# EAGLE design Routing_option1a (EAGLE 9.6.2)
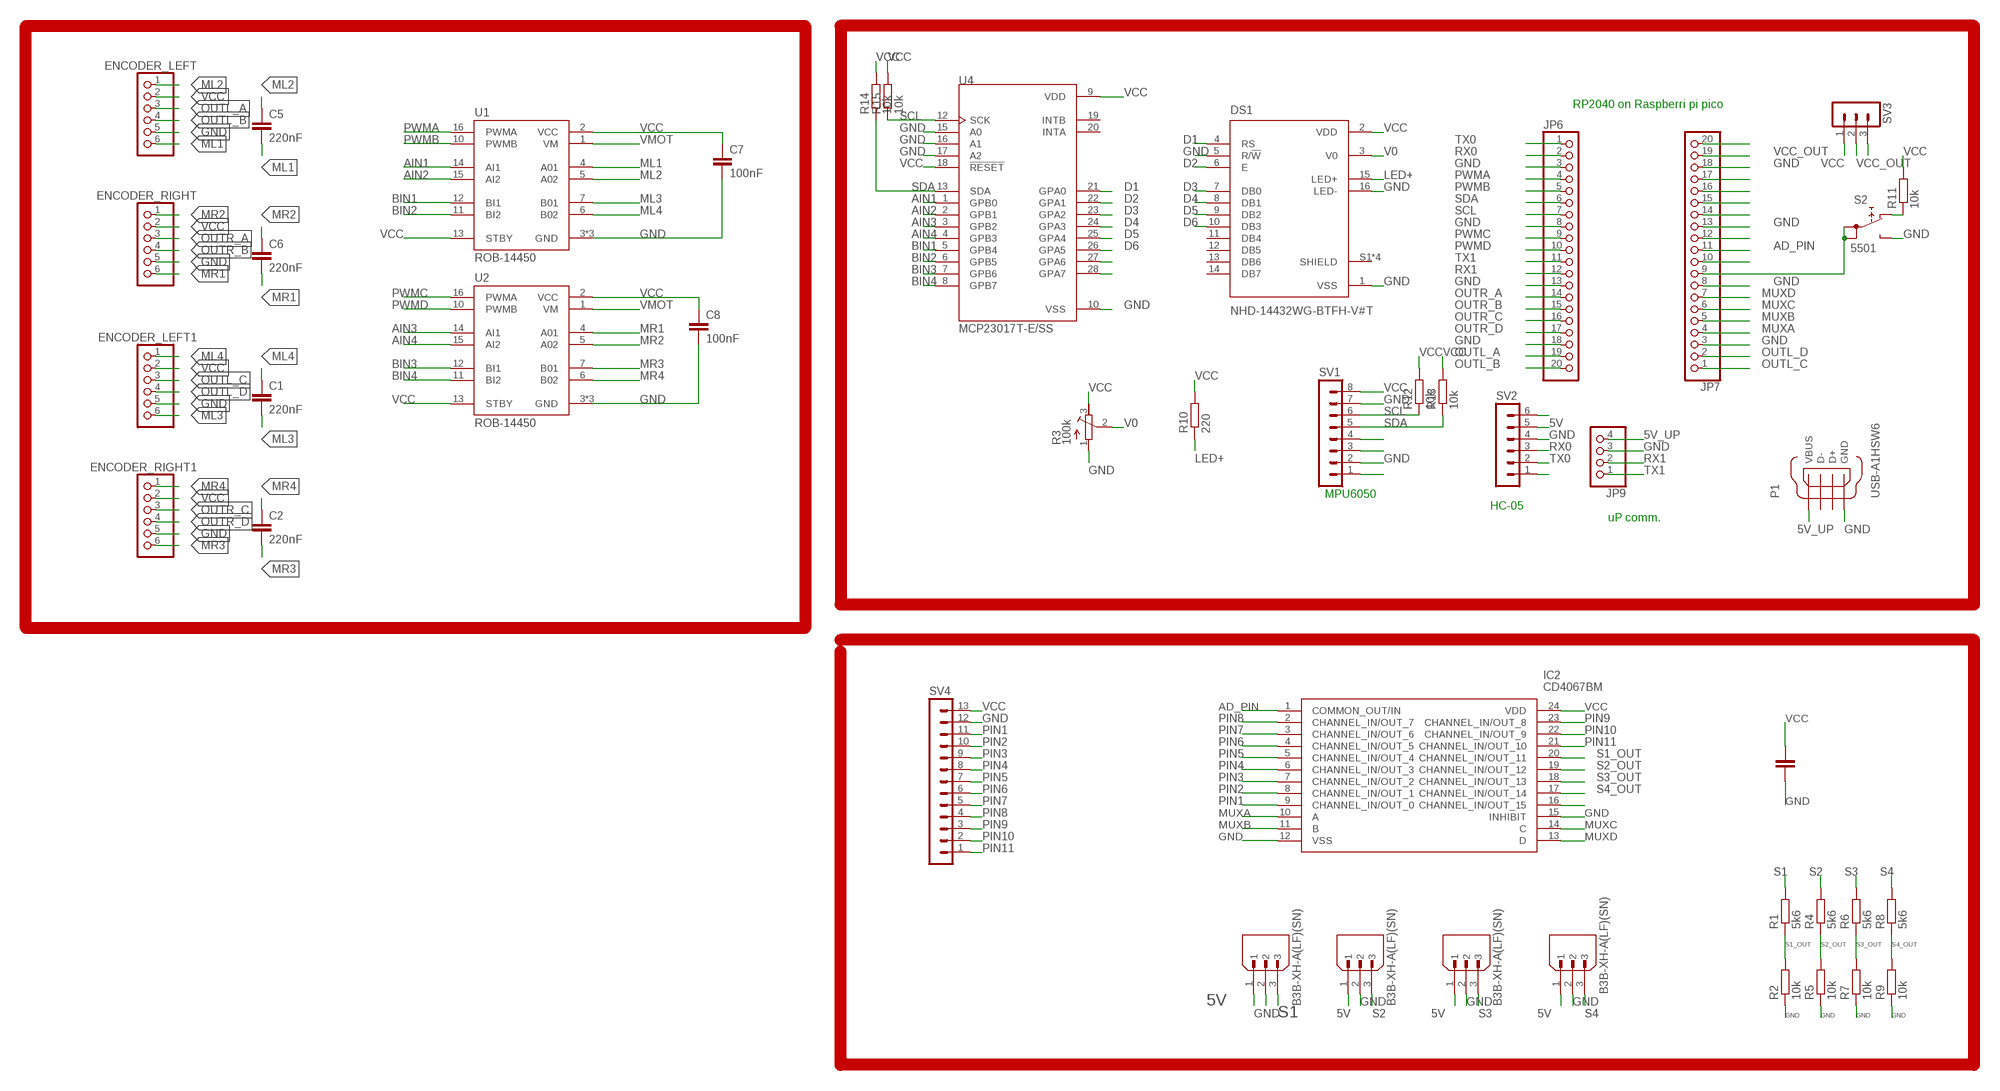
[diagram p0: schematic, sheet 1, part 1 of 2]
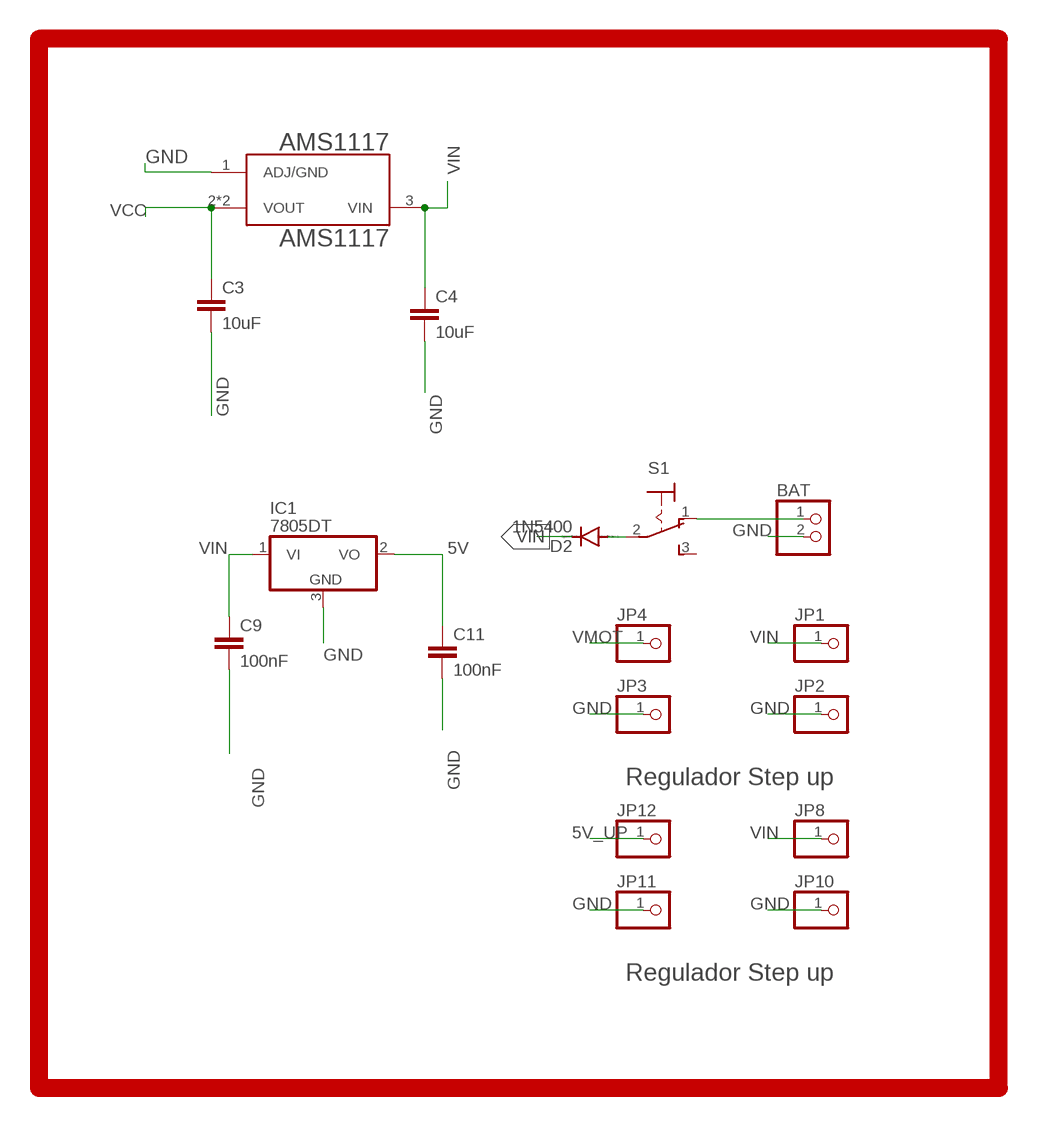
[diagram p1: schematic, sheet 1, part 2 of 2]

## Parts
AMS1117  AMS1117  [SOT229P700X180-4N]
BAT  PINHD-1X2  [1X02]
C1  220nF  C-EUC0805  [C0805]
C2  220nF  C-EUC0805  [C0805]
C3  10uF  C-EUC0805  [C0805]
C4  10uF  C-EUC0805  [C0805]
C5  220nF  C-EUC0805  [C0805]
C6  220nF  C-EUC0805  [C0805]
C7  100nF  C-EUC0805  [C0805]
C8  100nF  C-EUC0805  [C0805]
C9  100nF  C-EUC0805  [C0805]
C10  100nF  C-EUC0805  [C0805]
C11  100nF  C-EUC0805  [C0805]
D2  1N5400  [DO201-15]
DIR  B3B-XH-A(LF)(SN)  [JST_B3B-XH-A(LF)(SN)]
DS1  NHD-14432WG-BTFH-V#T  [LCD_NHD-14432WG-BTFH-V#T]
ENCODER_LEFT  PINHD-1X6  [1X06]
ENCODER_LEFT1  PINHD-1X6  [1X06]
ENCODER_RIGHT  PINHD-1X6  [1X06]
ENCODER_RIGHT1  PINHD-1X6  [1X06]
ESQ  B3B-XH-A(LF)(SN)  [JST_B3B-XH-A(LF)(SN)]
FRENT  B3B-XH-A(LF)(SN)  [JST_B3B-XH-A(LF)(SN)]
IC1  7805DT  [TO252]
IC2  CD4067BM  [SOIC127P1030X265-24N]
JP1  PINHD-1X1  [1X01]
JP2  PINHD-1X1  [1X01]
JP3  PINHD-1X1  [1X01]
JP4  PINHD-1X1  [1X01]
JP6  PINHD-1X20  [1X20]
JP7  PINHD-1X20  [1X20]
JP8  PINHD-1X1  [1X01]
JP9  PINHD-1X4  [1X04]
JP10  PINHD-1X1  [1X01]
JP11  PINHD-1X1  [1X01]
JP12  PINHD-1X1  [1X01]
P1  USB-A1HSW6  [OST_USB-A1HSW6]
R1  5k6  R-EU_R0805  [R0805]
R2  10k  R-EU_R0805  [R0805]
R3  100k  R-TRIMM64W  [RTRIM64W]
R4  5k6  R-EU_R0805  [R0805]
R5  10k  R-EU_R0805  [R0805]
R6  5k6  R-EU_R0805  [R0805]
R7  10k  R-EU_R0805  [R0805]
R8  5k6  R-EU_R0805  [R0805]
R9  10k  R-EU_R0805  [R0805]
R10  220  R-EU_R0805  [R0805]
R11  10k  R-EU_R0805  [R0805]
R12  10k  R-EU_R0805  [R0805]
R13  10k  R-EU_R0805  [R0805]
R14  10k  R-EU_R0805  [R0805]
R15  10k  R-EU_R0805  [R0805]
S1  320-916  [320-916]
S2  5501  [5501]
SV1  MA08-1  [MA08-1]
SV2  MA06-1  [MA06-1]
SV3  MA03-1  [MA03-1]
SV4  MA13-1  [MA13-1]
TRAS  B3B-XH-A(LF)(SN)  [JST_B3B-XH-A(LF)(SN)]
U1  ROB-14450  [MODULE_ROB-14450]
U2  ROB-14450  [MODULE_ROB-14450]
U4  MCP23017T-E/SS  [SOP65P780X200-28N]

## Nets
5V: C11.1 DIR.1 ESQ.1 FRENT.1 IC1.2(VO) SV2.5 TRAS.1
5V_UP: JP9.4 JP12.1 P1.1(VBUS)
AD1: JP7.12
AD2: JP7.14
AD_PIN: IC2.1(COMMON_OUT/IN) JP7.11
AIN1: U1.14(AI1) U4.1(GPB0)
AIN2: U1.15(AI2) U4.2(GPB1)
AIN3: U2.14(AI1) U4.3(GPB2)
AIN4: U2.15(AI2) U4.4(GPB3)
BIN1: U1.12(BI1) U4.5(GPB4)
BIN2: U1.11(BI2) U4.6(GPB5)
BIN3: U2.12(BI1) U4.7(GPB6)
BIN4: U2.11(BI2) U4.8(GPB7)
D1: DS1.4(RS) U4.21(GPA0)
D2: DS1.6(E) U4.22(GPA1)
D3: DS1.7(DB0) U4.23(GPA2)
D4: DS1.8(DB1) U4.24(GPA3)
D5: DS1.9(DB2) U4.25(GPA4)
D6: DS1.10(DB3) U4.26(GPA5)
GND: AMS1117.1(ADJ/GND) BAT.2 C3.2 C4.2 C7.2 C8.2 C9.2 C10.2 C11.2 DIR.2 DS1.1(VSS) DS1.5(R/!W) DS1.16(LED-) ENCODER_LEFT1.5 ENCODER_LEFT.5 ENCODER_RIGHT1.5 ENCODER_RIGHT.5 ESQ.2 FRENT.2 IC1.3(GND) IC2.12(VSS) IC2.15(INHIBIT) JP2.1 JP3.1 JP6.3 JP6.8 JP6.13 JP6.18 JP7.3 JP7.8 JP7.13 JP7.18 JP9.3 JP10.1 JP11.1 P1.4(GND) R2.1 R3.1(A) R5.1 R7.1 R9.1 S2.NO SV1.2 SV1.7 SV2.4 SV4.12 TRAS.2 U1.3(GND) U1.8(GND) U1.9(GND) U2.3(GND) U2.8(GND) U2.9(GND) U4.10(VSS) U4.15(A0) U4.16(A1) U4.17(A2)
LED+: DS1.15(LED+) R10.1
ML1: C5.2 ENCODER_LEFT.6 U1.4(A01)
ML2: C5.1 ENCODER_LEFT.1 U1.5(A02)
ML3: C1.2 ENCODER_LEFT1.6 U1.7(B01)
ML4: C1.1 ENCODER_LEFT1.1 U1.6(B02)
MR1: C6.2 ENCODER_RIGHT.6 U2.4(A01)
MR2: C6.1 ENCODER_RIGHT.1 U2.5(A02)
MR3: C2.2 ENCODER_RIGHT1.6 U2.7(B01)
MR4: C2.1 ENCODER_RIGHT1.1 U2.6(B02)
MUXA: IC2.10(A) JP7.4
MUXB: IC2.11(B) JP7.5
MUXC: IC2.14(C) JP7.6
MUXD: IC2.13(D) JP7.7
N$2: D2.A S1.2(P)
N$3: BAT.1 S1.1(O)
N$4: R11.1 S2.NC
N$5: SV3.3
N$13: SV1.4
N$14: SV1.3
N$16: SV1.1
N$17: SV2.6
N$26: SV2.1
N$47: U4.27(GPA6)
N$48: U4.28(GPA7)
NET$4: JP7.20
NET$5: JP7.17
NET$6: JP7.16
NET$7: JP7.15
NET$8: JP7.10
NET$15: JP7.9 S2.1A S2.1B
OUTL_A: ENCODER_LEFT.3 JP6.19
OUTL_B: ENCODER_LEFT.4 JP6.20
OUTL_C: ENCODER_LEFT1.3 JP7.1
OUTL_D: ENCODER_LEFT1.4 JP7.2
OUTR_A: ENCODER_RIGHT.3 JP6.14
OUTR_B: ENCODER_RIGHT.4 JP6.15
OUTR_C: ENCODER_RIGHT1.3 JP6.16
OUTR_D: ENCODER_RIGHT1.4 JP6.17
PIN1: IC2.9(CHANNEL_IN/OUT_0) SV4.11
PIN2: IC2.8(CHANNEL_IN/OUT_1) SV4.10
PIN3: IC2.7(CHANNEL_IN/OUT_2) SV4.9
PIN4: IC2.6(CHANNEL_IN/OUT_3) SV4.8
PIN5: IC2.5(CHANNEL_IN/OUT_4) SV4.7
PIN6: IC2.4(CHANNEL_IN/OUT_5) SV4.6
PIN7: IC2.3(CHANNEL_IN/OUT_6) SV4.5
PIN8: IC2.2(CHANNEL_IN/OUT_7) SV4.4
PIN9: IC2.23(CHANNEL_IN/OUT_8) SV4.3
PIN10: IC2.22(CHANNEL_IN/OUT_9) SV4.2
PIN11: IC2.21(CHANNEL_IN/OUT_10) SV4.1
PWMA: JP6.4 U1.16(PWMA)
PWMB: JP6.5 U1.10(PWMB)
PWMC: JP6.9 U2.16(PWMA)
PWMD: JP6.10 U2.10(PWMB)
RX0: JP6.2 SV2.3
RX1: JP6.12 JP9.2
S1: FRENT.3 R1.2
S1_OUT: IC2.20(CHANNEL_IN/OUT_11) R1.1 R2.2
S2: ESQ.3 R4.2
S2_OUT: IC2.19(CHANNEL_IN/OUT_12) R4.1 R5.2
S3: DIR.3 R6.2
S3_OUT: IC2.18(CHANNEL_IN/OUT_13) R6.1 R7.2
S4: R8.2 TRAS.3
S4_OUT: IC2.17(CHANNEL_IN/OUT_14) R8.1 R9.2
S5: IC2.16(CHANNEL_IN/OUT_15)
SCL: JP6.7 R12.1 R15.1 SV1.6 U4.12(SCK)
SDA: JP6.6 R13.1 R14.1 SV1.5 U4.13(SDA)
TX0: JP6.1 SV2.2
TX1: JP6.11 JP9.1
V0: DS1.3(V0) R3.2(S)
VCC: AMS1117.2(VOUT) AMS1117.4(VOUT) C3.1 C7.1 C8.1 C10.1 DS1.2(VDD) ENCODER_LEFT1.2 ENCODER_LEFT.2 ENCODER_RIGHT1.2 ENCODER_RIGHT.2 IC2.24(VDD) R3.3(E) R10.2 R11.2 R12.2 R13.2 R14.2 R15.2 SV1.8 SV3.1 SV4.13 U1.2(VCC) U1.13(STBY) U2.2(VCC) U2.13(STBY) U4.9(VDD) U4.18(!RESET)
VCC_OUT: JP7.19 SV3.2
VIN: AMS1117.3(VIN) C4.1 C9.1 D2.C IC1.1(VI) JP1.1 JP8.1
VMOT: JP4.1 U1.1(VM) U2.1(VM)
Unconnected: DS1.11(DB4) DS1.12(DB5) DS1.13(DB6) DS1.14(DB7) DS1.S1(SHIELD) DS1.S2(SHIELD) DS1.S3(SHIELD) DS1.S4(SHIELD) P1.2(D-) P1.3(D+) S1.3(S) U4.19(INTB) U4.20(INTA)

## Notes on the sheet
- RP2040 on Raspberri pi pico
- MPU6050
- HC-05
- uP comm. | Regulador Step up
- Regulador Step up

## Library data of the parts
AMS1117 = AMS1117_REGULADOR:AMS1117: Sot223/Pkg 1-Amp 5-Volt Low Drop Out Voltage Regulatator Check prices <https://pricing.snapeda.com/parts/AMS1117/Advanced%20Monolithic%20Systems/view-part?ref=eda>; AVAILABILITY: In Stock; DESCRIPTION: 1A LOW DROPOUT VOLTAGE REGULATOR SOT-223; MF: Advanced Monolithic Systems; MP: AMS1117; PACKAGE: SOT-223 Seeed Technology; PRICE: None
BAT = pinhead:PINHD-1X2: PIN HEADER
C1-C11 = rcl:C-EU: CAPACITOR, European symbol; SPICEPREFIX: C
D2 = diode:1N5400: DIODE standard rectifier, 3 A, 50 V (Motorola)
DIR ESQ FRENT TRAS = B3B-XH-A_LF__SN_:B3B-XH-A(LF)(SN): Check availability <https://pricing.snapeda.com/parts/B3B-XH-A%28LF%29%28SN%29/JST%20Sales/view-part?ref=eda>; AVAILABILITY: In Stock; DESCRIPTION: Connector Header Through Hole 3 position 0.098 (2.50mm); MF: JST Sales; MP: B3B-XH-A(LF)(SN); PACKAGE: None; PRICE: None; PURCHASE-URL: https://pricing.snapeda.com/search/part/B3B-XH-A(LF)(SN)/?ref=eda
DS1 = NHD-14432WG-BTFH-V_T:NHD-14432WG-BTFH-V#T: LCD Graphic Display; 144x32 Pixels; 80x36; FSTN (+); Transflective; 8-Bit Parallel Check availability <https://pricing.snapeda.com/parts/NHD-14432WG-BTFH-V%23T/Newhaven%20Display/view-part?ref=eda>; AVAILABILITY: In Stock; DESCRIPTION: - Graphic LCD Display Module Transflective Black (White - Inverted) FSTN - Film Super-Twisted Nematic Parallel, 8-Bit - 144 x 32; MF: Newhaven Display; MP: NHD-14432WG-BTFH-V#T; PACKAGE: None; PRICE: None; PURCHASE-URL: https://pricing.snapeda.com/search?q=NHD-14432WG-BTFH-V#T&ref=eda
ENCODER_LEFT ENCODER_LEFT1 ENCODER_RIGHT ENCODER_RIGHT1 = pinhead:PINHD-1X6: PIN HEADER
IC1 = linear:78*: Positive VOLTAGE REGULATOR Source: http://cache.national.com/ds/LM/LM78L05.pdf http://www.fairchildsemi.com/ds/LM/LM7805.pdf
IC2 = CD4067BM:CD4067BM: Analog Multiplexer/Demultiplexer SOIC24 Texas Instruments CD4067BM, Multiplexer/Demultiplexer Single 16:1, 3 18 V, 24-Pin SOIC Source: Datasheet <http://www.ti.com/lit/ds/symlink/cd4067b.pdf>; ARROW_PART_NUMBER: CD4067BM; ARROW_PRICE-STOCK: https://www.arrow.com/en/products/cd4067bm/texas-instruments; DESCRIPTION: Analog Multiplexer/Demultiplexer SOIC24 Texas Instruments CD4067BM, Multiplexer/Demultiplexer Single 16:1, 3 18 V, 24-Pin SOIC; HEIGHT: 2.65mm; MANUFACTURER_NAME: Texas Instruments; MANUFACTURER_PART_NUMBER: CD4067BM; MOUSER_PART_NUMBER: 595-CD4067BM; MOUSER_PRICE-STOCK: https://www.mouser.co.uk/ProductDetail/Texas-Instruments/CD4067BM?qs=LSR%252BNeaw%2FwBojsvkXxI5Ew%3D%3D
JP1-JP4 JP8 JP10-JP12 = pinhead:PINHD-1X1: PIN HEADER
JP6 JP7 = pinhead:PINHD-1X20: PIN HEADER
JP9 = pinhead:PINHD-1X4: PIN HEADER
P1 = USB-A1HSW6:USB-A1HSW6: USB - A Receptacle Connector 4 Position Through Hole, Right Angle Check availability <https://pricing.snapeda.com/parts/USB-A1HSW6/On%20Shore/view-part?ref=eda>; AVAILABILITY: In Stock; DESCRIPTION: USB-A (USB TYPE-A) - Receptacle Connector 4 Position Through Hole, Right Angle; MF: On Shore; MP: USB-A1HSW6; PACKAGE: None; PRICE: None; PURCHASE-URL: https://pricing.snapeda.com/search?q=USB-A1HSW6&ref=eda
R1 R2 R4-R15 = rcl:R-EU_: RESISTOR, European symbol; SPICEPREFIX: R
R3 = rcl:R-TRIMM: Trimm resistor; SPICEMODEL: X; SPICEPREFIXL: POT
S1 = switch:320-916: TOGGLE SWITCH distributor RS Components
S2 = switch:55?: PUSHBUTTON SERIES 5500 SWITCHES Source: www.e-switch.com .. 5500.pdf
SV1 = con-lstb:MA08-1: PIN HEADER; OC_FARNELL: unknown; OC_NEWARK: unknown
SV2 = con-lstb:MA06-1: PIN HEADER; OC_FARNELL: unknown; OC_NEWARK: unknown
SV3 = con-lstb:MA03-1: PIN HEADER; OC_FARNELL: unknown; OC_NEWARK: unknown
SV4 = con-lstb:MA13-1: PIN HEADER; OC_FARNELL: unknown; OC_NEWARK: unknown
U1 U2 = ROB-14450:ROB-14450: TB6612FNG Motor Controller/Driver Power Management Evaluation Board Check availability <https://pricing.snapeda.com/parts/ROB-14450/SparkFun%20Electronics/view-part?ref=eda>; AVAILABILITY: In Stock; DESCRIPTION: TB6612FNG Motor Controller/Driver Power Management Evaluation Board; MF: SparkFun Electronics; MP: ROB-14450; PACKAGE: None; PRICE: None; PURCHASE-URL: https://pricing.snapeda.com/search/part/ROB-14450/?ref=eda
U4 = MCP23017T-E_SS:MCP23017T-E/SS: 16-bit Input/Output Expander, I2C interface, Pb-free28 SSOP .209in T/R Check availability <https://pricing.snapeda.com/parts/MCP23017T-E/SS/Microchip/view-part?ref=eda>; AVAILABILITY: In Stock; DESCRIPTION: I/O Expander 16 I²C 1.7 MHz 28-SSOP; MF: Microchip; MP: MCP23017T-E/SS; PACKAGE: SSOP-28 Microchip; PRICE: None; PURCHASE-URL: https://pricing.snapeda.com/search?q=MCP23017T-E/SS&ref=eda

## Board
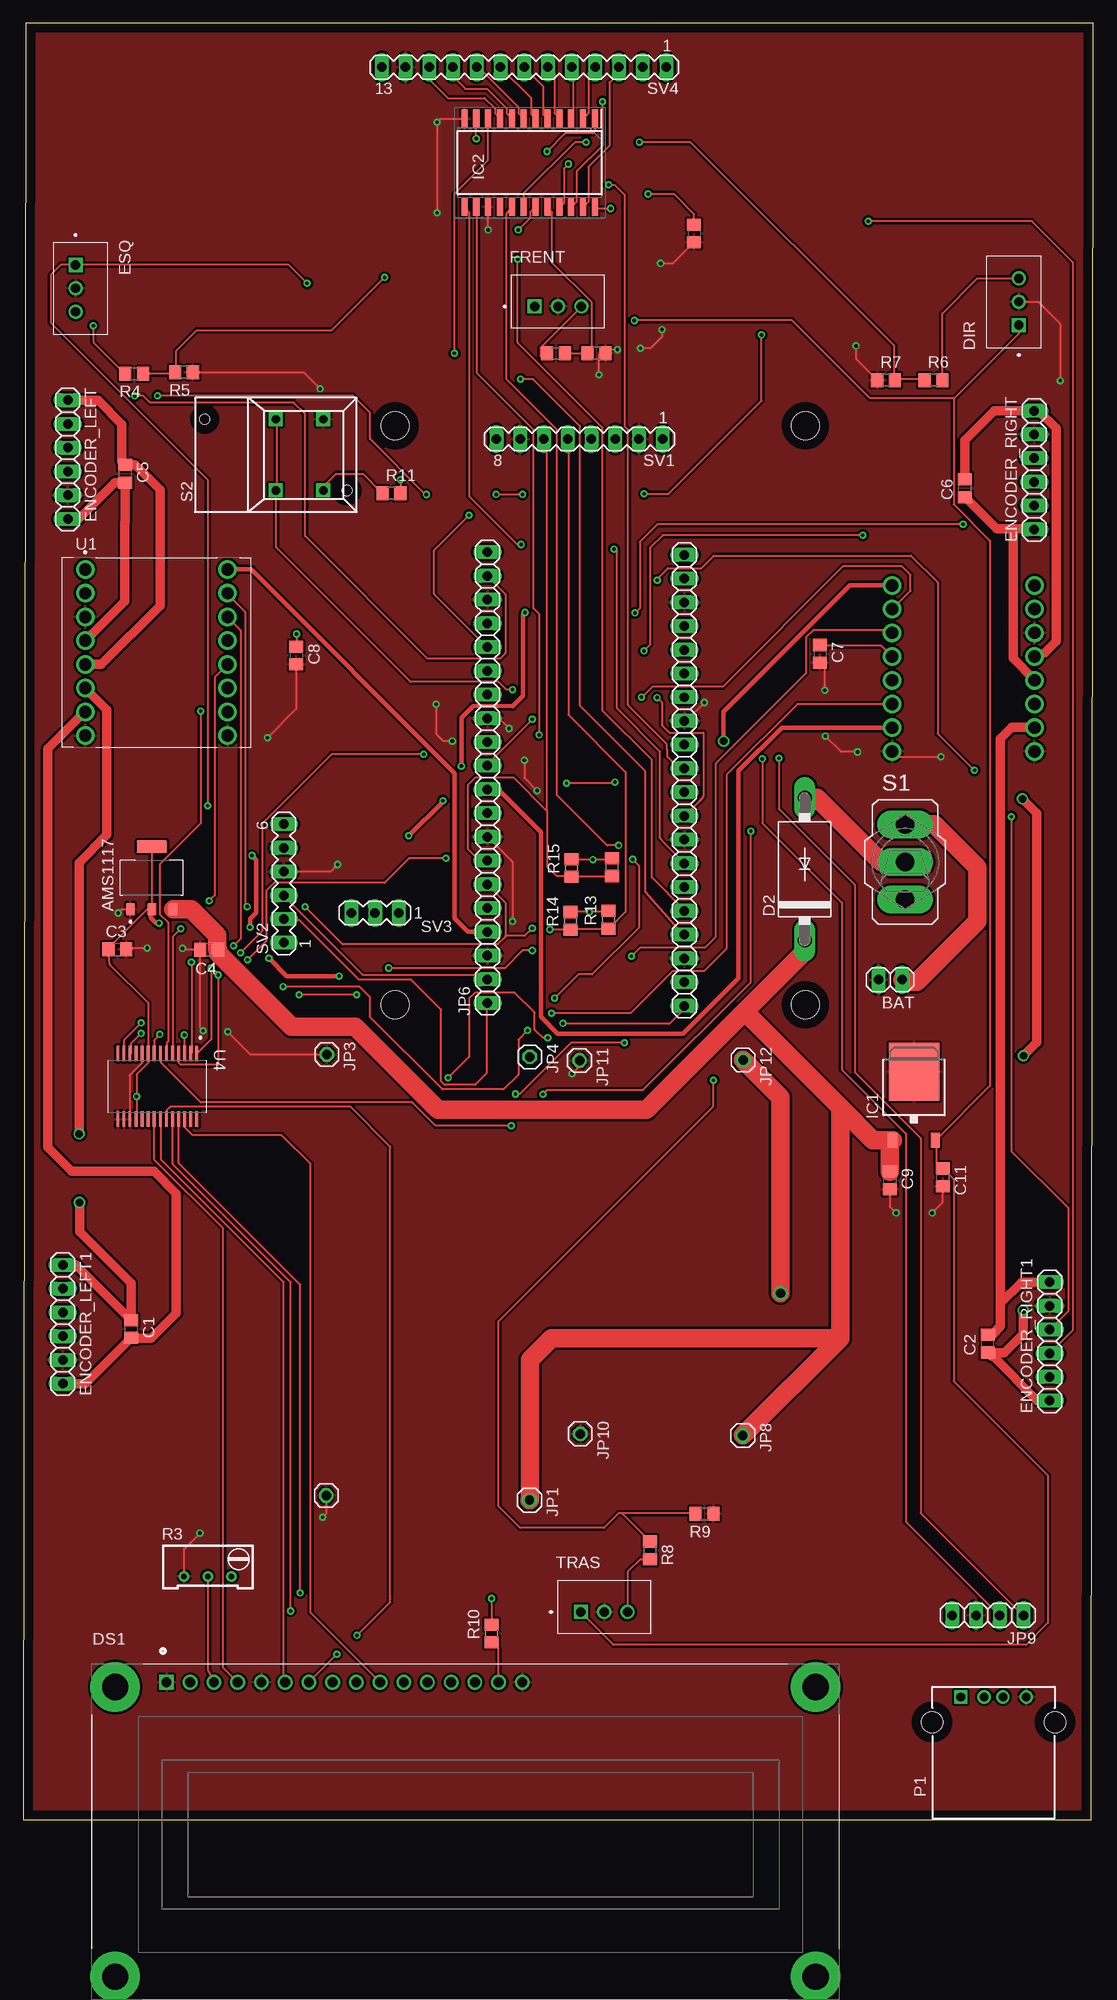
[diagram p2: board, top side]
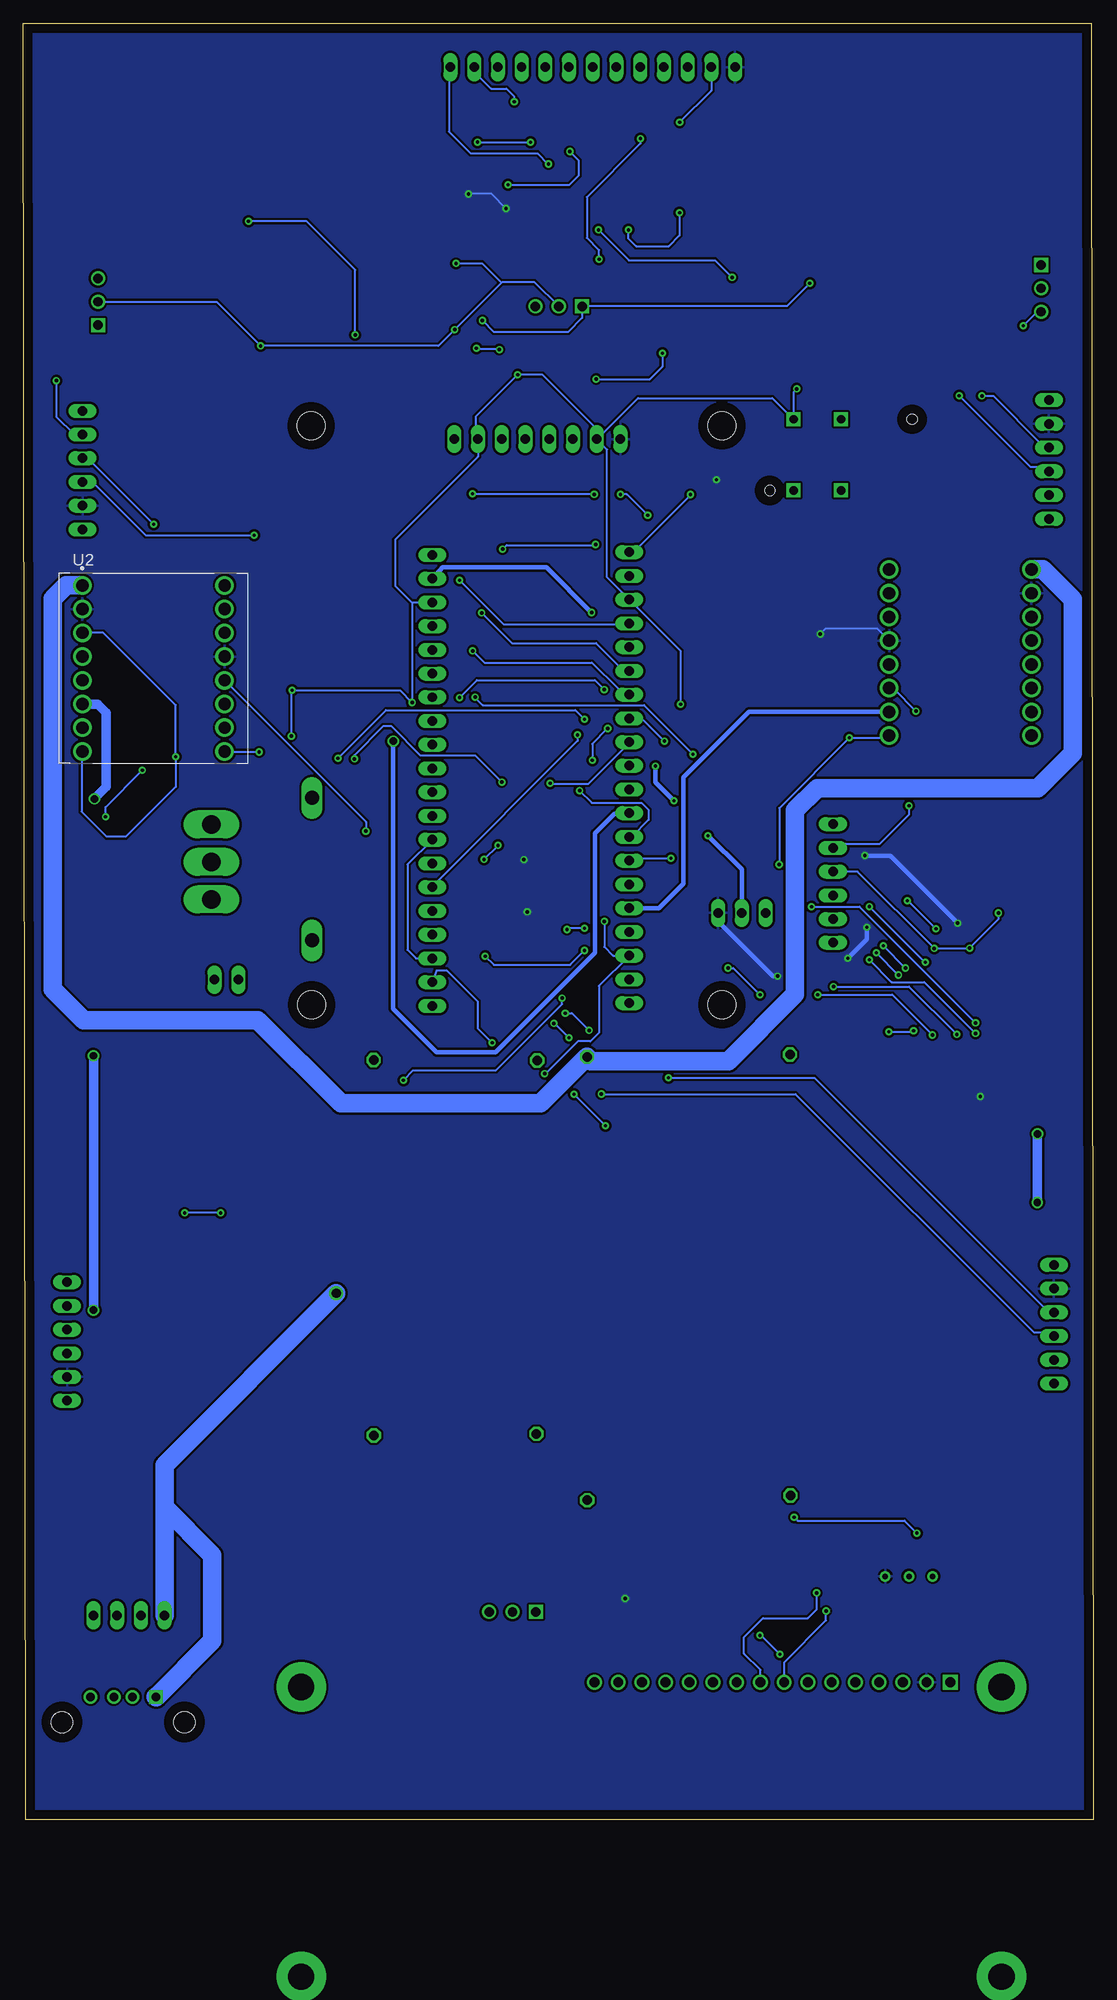
[diagram p3: board, bottom side, seen from below]

Size 114.58 x 192.29 mm. Coordinates in mm from the lower left corner, seen from the top.
Outline: 0,0 114.35,0 114.58,192.29 0.23,192.29 0,0
Copper layers (1*16): Top 0.035mm / dielectric 1.5mm / Bottom 0.035mm
Design rules "default *": minimum track width 0.2mm, minimum drill 0.35mm, track to track 10mil, track to pad 10mil, pad to pad 10mil, via to via 10mil, smd to smd 10mil, copper to edge 40mil, drill to drill 6mil, minimum pad ring 10mil, minimum via ring 8mil, stop-mask expansion 4mil, vias tented up to drill 0mil, thermal gap 10mil
Holes 3 mm at 39.78,149.23 39.8,87.24 83.72,87.27 83.75,149.2

### Footprints (pad centres in the part's own frame; a part is rotated, then mirrored left to right if it is on the bottom)
SOT229P700X180-4N = smd 1.31 x 0.93: 1 -3.345,2.29; 2 -3.345,0; 3 -3.345,-2.29 | smd 1.31 x 3.24: 4 3.345,0
1X02 = drill 1.016 long: 1 -1.27,0; 2 1.27,0
C0805 = smd 1.3 x 1.5: 1 -0.95,0; 2 0.95,0
DO201-15 = drill 1.499 long: A 7.62,0; C -7.62,0
JST_B3B-XH-A(LF)(SN) = drill 1 square: 1 -2.5,-0.525 | drill 1: 2 0,-0.525; 3 2.5,-0.525
LCD_NHD-14432WG-BTFH-V#T = drill 1.05 square: 1 -32.55,16.3 | drill 1.05: 2 -30.01,16.3; 3 -27.47,16.3; 4 -24.93,16.3; 5 -22.39,16.3; 6 -19.85,16.3; 7 -17.31,16.3; 8 -14.77,16.3; 9 -12.23,16.3; 10 -9.69,16.3; 11 -7.15,16.3; 12 -4.61,16.3; 13 -2.07,16.3; 14 0.47,16.3; 15 3.01,16.3; 16 5.55,16.3 | drill 2.8 pad 5.3: S1 -38.05,15.8; S2 -38.05,-15.2; S3 36.95,15.8; S4 36.95,-15.2
1X06 = drill 1.016 long: 1 -6.35,0; 2 -3.81,0; 3 -1.27,0; 4 1.27,0; 5 3.81,0; 6 6.35,0
TO252 = smd 1 x 1.6: 1 -2.28,-4.8; 2 2.28,-4.8 | smd 5.4 x 6.2: 3 0,2.5
SOIC127P1030X265-24N = smd 1.95 x 0.65: 1 -4.725,6.985; 2 -4.725,5.715; 3 -4.725,4.445; 4 -4.725,3.175; 5 -4.725,1.905; 6 -4.725,0.635; 7 -4.725,-0.635; 8 -4.725,-1.905; 9 -4.725,-3.175; 10 -4.725,-4.445; 11 -4.725,-5.715; 12 -4.725,-6.985; 13 4.725,-6.985; 14 4.725,-5.715; 15 4.725,-4.445; 16 4.725,-3.175; 17 4.725,-1.905; 18 4.725,-0.635; 19 4.725,0.635; 20 4.725,1.905; 21 4.725,3.175; 22 4.725,4.445; 23 4.725,5.715; 24 4.725,6.985
1X01 = drill 1.016 octagon: 1 0,0
1X20 = drill 1.016 long: 1 -24.13,0; 2 -21.59,0; 3 -19.05,0; 4 -16.51,0; 5 -13.97,0; 6 -11.43,0; 7 -8.89,0; 8 -6.35,0; 9 -3.81,0; 10 -1.27,0; 11 1.27,0; 12 3.81,0; 13 6.35,0; 14 8.89,0; 15 11.43,0; 16 13.97,0; 17 16.51,0; 18 19.05,0; 19 21.59,0; 20 24.13,0
1X04 = drill 1.016 long: 1 -3.81,0; 2 -1.27,0; 3 1.27,0; 4 3.81,0
OST_USB-A1HSW6 = drill 0.92 square: 1 -3.5,6.51 | drill 0.92: 2 -1,6.51; 3 1,6.51; 4 3.5,6.51 | hole 2.3: -6.57,3.8; 6.57,3.8
R0805 = smd 1.3 x 1.5: 1 -0.95,0; 2 0.95,0
RTRIM64W = drill 0.61: 1 1.27,-2.54; 2 1.27,0; 3 1.27,2.54
320-916 = drill 2.007 long: 1 0,4.013; 2 0,0; 3 0,-4.013
5501 = drill 0.9 pad 1.5 square: 1A 0,3.81; 1B 0,-3.81; NC 5.08,-3.81; NO 5.08,3.81 | hole 1.1: -7.62,3.81; 7.62,-3.81
MA08-1 = drill 1.016 long: 1 -8.89,0; 2 -6.35,0; 3 -3.81,0; 4 -1.27,0; 5 1.27,0; 6 3.81,0; 7 6.35,0; 8 8.89,0
MA06-1 = drill 1.016 long: 1 -6.35,0; 2 -3.81,0; 3 -1.27,0; 4 1.27,0; 5 3.81,0; 6 6.35,0
MA03-1 = drill 1.016 long: 1 -2.54,0; 2 0,0; 3 2.54,0
MA13-1 = drill 1.016 long: 1 -15.24,0; 2 -12.7,0; 3 -10.16,0; 4 -7.62,0; 5 -5.08,0; 6 -2.54,0; 7 0,0; 8 2.54,0; 9 5.08,0; 10 7.62,0; 11 10.16,0; 12 12.7,0; 13 15.24,0
MODULE_ROB-14450 = drill 1.32: 1 -7.62,8.89; 2 -7.62,6.35; 3 -7.62,3.81; 4 -7.62,1.27; 5 -7.62,-1.27; 6 -7.62,-3.81; 7 -7.62,-6.35; 8 -7.62,-8.89; 9 7.62,-8.89; 10 7.62,-6.35; 11 7.62,-3.81; 12 7.62,-1.27; 13 7.62,1.27; 14 7.62,3.81; 15 7.62,6.35; 16 7.62,8.89
SOP65P780X200-28N = smd 1.651 x 0.432: 1 -3.505,4.225; 2 -3.505,3.575; 3 -3.505,2.925; 4 -3.505,2.275; 5 -3.505,1.625; 6 -3.505,0.975; 7 -3.505,0.325; 8 -3.505,-0.325; 9 -3.505,-0.975; 10 -3.505,-1.625; 11 -3.505,-2.275; 12 -3.505,-2.925; 13 -3.505,-3.575; 14 -3.505,-4.225; 15 3.505,-4.225; 16 3.505,-3.575; 17 3.505,-2.925; 18 3.505,-2.275; 19 3.505,-1.625; 20 3.505,-0.975; 21 3.505,-0.325; 22 3.505,0.325; 23 3.505,0.975; 24 3.505,1.625; 25 3.505,2.275; 26 3.505,2.925; 27 3.505,3.575; 28 3.505,4.225

### Placement (x,y rotation side)
AMS1117  13.75,100.83 90 top
BAT  92.82,89.93 180 top
C1  11.53,52.54 270 top
C2  103.26,50.98 90 top
C3  10.06,93.18 0 top
C4  19.9,93.12 180 top
C5  10.89,144.08 270 top
C6  100.82,142.53 90 top
C7  85.29,124.8 270 top
C8  29.23,124.63 270 top
C9  92.77,68.45 270 top
C10  71.82,169.8 270 top
C11  98.45,68.78 270 top
D2  83.66,101.77 90 top
DIR  106.06,162.49 90 top
DS1  47.88,-1.57 0 top
ENCODER_LEFT  4.75,145.61 270 top
ENCODER_LEFT1  4.22,53.06 270 top
ENCODER_RIGHT  108.24,144.47 90 top
ENCODER_RIGHT1  109.9,51.22 90 top
ESQ  6.12,163.93 270 top
FRENT  57.25,162.51 0 top
IC1  95.36,77.57 0 top
IC2  54.21,177.37 270 top
JP1  54.2,34.22 270 top
JP2  32.43,34.73 270 top
JP3  32.49,81.93 270 top
JP4  54.22,81.67 270 top
JP6  49.69,111.56 90 top
JP7  70.78,111.27 90 top
JP8  77.05,41.15 270 top
JP9  103.27,21.91 180 top
JP10  59.64,41.33 270 top
JP11  59.56,81.28 270 top
JP12  77.06,81.34 270 top
P1  103.88,6.66 0 top
R1  57.03,156.95 180 top
R2  61.37,156.97 180 top
R3  19.75,27.34 270 top
R4  11.87,154.79 180 top
R5  17.2,154.93 180 top
R6  97.45,154.11 0 top
R7  92.37,154.11 0 top
R8  67.08,28.86 270 top
R9  72.93,32.75 180 top
R10  50.13,19.96 90 top
R11  39.42,142 0 top
R12  63.03,101.98 90 top
R13  62.66,96.35 90 top
R14  58.59,96.23 90 top
R15  58.71,101.89 90 top
S1  94.43,102.54 0 top
S2  27.03,146.11 0 top
SV1  59.55,147.8 180 top
SV2  27.89,100.24 90 top
SV3  37.64,97.08 180 top
SV4  53.61,187.6 180 top
TRAS  62.2,22.79 0 top
U1  14.25,124.95 0 top
U2  100.64,123.25 0 bottom
U4  14.35,78.52 270 top

### Tracks (layer width: path | path; a pad name or v marks a point on that pad's centre or on a via)
5V  (via drill 0.35)
  Top 0.2: 97.75,70.47 | 97.75,70.47 97.75,72.68 IC1.2 97.75,72.81 103.5,78.56 103.5,136.93 99.62,140.81 99.62,152.12 | 97.75,70.47 C11.1 98.5,69.68 99.62,68.56 99.62,46.96 109.7,36.88 109.7,21.09 107.37,18.75 63.18,18.75 59.75,22.18 TRAS.1 | 99.62,152.12 99.62,152.17 90.63,152.17 82.32,160.49 v65.42,160.49 | DIR.1 106.58,159.08 99.62,152.12 | 5.62,166.43 28.41,166.43 v30.37,164.47 | 5.62,166.43 4,166.43 2.95,165.38 2.95,160.23 19.75,143.43 v19.75,108.56 | 5.62,166.43 ESQ.1
  Bottom 0.2: v65.42,160.49 64.24,159.31 56.2,159.31 54.75,160.75 FRENT.1 54.75,162.06 32.78,162.06 v30.37,164.47 | v19.75,108.56 19.75,107.6 22.92,104.43 27.5,104.43 27.87,104.06 SV2.5
5V_UP  (via drill 1)
  Top 2: JP12.1 81.07,77.33 v81.07,56.38
  Bottom 2: v81.07,56.38 99.46,37.99 99.46,33.46 | 99.46,33.46 JP9.4 | 99.46,33.46 94.35,28.34 94.35,19.18 100.37,13.16 P1.1
AD_PIN  (via drill 0.35)
  Top 0.2: 61.25,182.18 IC2.1 61.2,180.73 60.99,180.52 58.02,180.52 v56.07,178.57 | 70.25,112.54 68.93,113.87 68.93,114.56 68.88,114.61 68.88,115.17 64.75,119.31 64.75,148.81 64.37,149.18 64.37,173.95 63.31,175.01 v62.67,175.01
  Top 0.25: 70.25,112.54 JP7.11
  Bottom 0.2: v56.07,178.57 55.16,177.66 55.16,175.95 56.12,174.99 62.65,174.99 v62.67,175.01
AIN1  (via drill 0.35)
  Top 0.2: v20.12,91.18 20.12,83.56 18.62,82.06 U4.1 | v22.5,93.56 23.25,94.31 23.25,127.31 21.87,128.68 U1.14
  Bottom 0.2: v22.5,93.56 v20.12,91.18
AIN2  (via drill 0.35)
  Top 0.2: v18,91.81 18,82.06 U4.2 | v23.98,97.76 23.75,97.99 23.75,129.31 21.87,131.18 U1.15
  Bottom 0.2: v23.98,97.76 18.03,91.81 v18,91.81
AIN3  (via drill 0.35)
  Top 0.2: v17.23,84.02 17.23,82.08 U4.3 | v29.52,88.32 v35.69,88.32 | v54.5,93.06 53.46,93.06 51.58,91.18 v39.12,91.18 | v65.12,92.43 66.04,93.35 72.97,93.35 74.12,94.5 74.12,113.04 83.81,122.73 83.81,126.58 84.58,127.35 92.7,127.35 93,127.06 U2.14
  Bottom 0.2: v17.23,84.02 21.54,88.32 v29.52,88.32 | v39.12,91.18 38.56,91.18 v35.69,88.32 | v65.12,92.43 64.2,91.52 56.04,91.52 v54.5,93.06
AIN4  (via drill 0.35)
  Top 0.2: v20.87,90.43 20.87,80.81 16.87,80.81 16.62,81.06 16.62,81.93 U4.4 | v23.25,92.81 25.54,95.11 25.54,106.61 33,114.06 v42.87,114.06 | v66.2,120.18 66.26,120.18 67.38,121.3 74.9,121.3 87.77,134.16 94.08,134.16 94.98,133.26 94.98,131.55 93.12,129.68 U2.15
  Bottom 0.2: v23.25,92.81 v20.87,90.43 | v42.87,114.06 48.12,119.31 65.39,119.31 66.2,120.11 v66.2,120.18
BIN1  (via drill 0.35)
  Top 0.2: v16.86,95.39 16,94.53 16,82.06 U4.5 | v19.91,98.38 20.5,98.96 20.5,122.31 21.75,123.56 U1.12
  Bottom 0.2: v19.91,98.38 19.85,98.38 v16.86,95.39
BIN2  (via drill 0.35)
  Top 0.2: v19,118.68 19,106.68 14.62,102.31 14.62,96.93 15.5,96.06 15.5,83.31 15.37,83.18 15.37,82.06 U4.6
  Bottom 0.2: v19,118.68 21.37,121.06 21.75,121.06 U1.11
BIN3  (via drill 0.35)
  Top 0.2: v52.25,74.31 44.12,74.31 41.62,76.81 19,76.81 14.75,81.06 14.75,81.93 U4.7 | v55.62,77.68 56.04,78.1 66.37,78.1 66.37,78.13 77.84,89.6 77.84,105.77 v77.91,105.84
  Bottom 0.2: v55.62,77.68 v52.25,74.31 | U2.12 77.88,106.83 77.88,105.87 v77.91,105.84
BIN4  (via drill 0.35)
  Top 0.2: v14.62,84.07 14,83.45 14,82.06 U4.8 | v27.82,89.2 36,89.2 37.12,88.08 37.12,85.93 44.87,78.18 51.41,78.18 53,79.77 53,83.51 v53.99,84.5 | v56.55,86.35 65,86.35 69.51,90.86 72.9,90.86 75.3,93.26 75.3,111.86 82.87,119.43 93,119.43 U2.11
  Bottom 0.2: v14.62,84.07 19.75,89.2 v27.82,89.2 | v56.55,86.35 55.84,86.35 v53.99,84.5
D1
  Top 0.2: U4.21 14,74.93 14,70.68 21.37,63.31 21.37,16.31 22.87,14.81 DS1.4
D2
  Top 0.2: U4.22 14.75,74.93 14.75,70.68 27.87,57.56 27.87,14.93 28,14.81 DS1.6
D3  (via drill 0.35)
  Top 0.2: 30.62,15.35 30.62,14.81 DS1.7 33.57,17.73 v33.57,17.74 | U4.23 15.37,75.06 15.37,75.93 15.75,76.31 35.05,76.31 39.28,72.07 39.28,23.96 39.28,23.64 39.28,23.32 v35.71,19.75
  Bottom 0.2: v33.57,17.74 35.57,19.75 v35.71,19.75
D4  (via drill 0.35)
  Top 0.2: v28.62,22.37 28.62,57.56 16,70.18 16,74.93 U4.24
  Bottom 0.2: DS1.8 33.11,16.87 28.62,21.36 v28.62,22.37
D5  (via drill 0.35)
  Top 0.2: U4.25 16.62,74.93 16.62,70.31 29.64,57.29 29.64,26.09 29.63,26.08 v29.63,24.3
  Bottom 0.2: DS1.9 35.65,16.06 37.4,17.81 37.4,19.57 35.37,21.6 30.57,21.6 29.63,22.54 v29.63,24.3
D6
  Top 0.2: U4.26 17.25,74.93 17.25,74.18 18.12,73.31 27.65,73.31 30.75,70.21 30.75,22.18 38.12,14.81 DS1.10
GND  (via drill 0.35)
  Top 0.2: v17.05,93.28 17.21,93.12 C4.2 18.95,84.77 v19.25,84.47 | v13.25,93.31 11.15,93.31 C3.2 | v10.16,97.07 10.58,97.49 AMS1117.1 | C8.2 29.23,118.91 v26.14,115.82 | v33.65,102.26 32.89,101.51 SV2.4 | v58.75,79.88 59.56,80.69 JP11.1 | JP6.8 52.37,102.54 v52.37,96.17 | v61.65,154.67 61.65,156.83 R2.1 62.72,157.37 v63.61,157.37 | v72.94,119.6 70.96,117.62 JP7.13 | v98.26,113.78 98.19,113.72 93.67,113.72 U2.9 | v85.81,120.9 85.81,123.34 C7.2 | C10.2 69.56,166.59 v68.24,166.59 | v66.07,157.52 v66.07,157.51 67.14,157.51 68.38,158.75 v68.38,159.51 | JP6.13 50.91,117.91 v52,116.82 | v53.65,113.42 53.65,111.53 v55.01,110.17 | C9.2 92.77,65.65 v93.45,64.97 | v97.31,64.97 98.44,66.11 C11.2 | R5.1 30,154.93 v31.77,153.17 | IC2.12 44.65,182.1 44.3,181.75 v44.3,181.71 44.3,172.02 v44.31,172.01 | v49.77,170.18 v49.77,170.19 IC2.15 | DIR.2 108.67,162.49 111.03,160.13 v111.03,154.05 | R7.1 89.16,156.37 v89.16,157.77 | U4.10 12.72,81.05 11.36,79.69 11.36,75.25 11.42,75.19 U4.17 | R3.1 17.21,29 v18.91,30.7 | JP2.1 32.44,34.72 32.44,32.8 v32.05,32.4 | v44.2,119.41 44.2,116.27 45.01,115.47 v45.93,115.47 | JP3.1 24.32,81.93 v21.89,84.35 | v89.32,114.3 87.58,114.3 v85.88,116.01
  Bottom 0.2: v10.16,97.07 10.16,96.43 13.25,93.33 v13.25,93.31 13.29,93.28 v17.05,93.28 25.27,101.51 SV2.4 | U1.9 22.12,115.82 v26.14,115.82 33.65,108.31 v33.65,102.26 | v58.75,79.88 58.66,79.88 55.21,83.34 53.85,83.34 52.94,84.25 52.94,89.27 JP6.3 51.43,92.51 52.37,93.45 v52.37,96.17 | 72.99,130.32 74.77,132.1 74.77,137.03 65.9,145.9 SV1.2 66.14,148.04 66.14,150.17 v61.65,154.67 58.97,154.67 53.2,148.9 SV1.7 53.18,147.77 | 72.99,130.32 JP7.18 | 72.99,130.32 72.94,130.27 v72.94,119.6 74.24,120.9 v85.81,120.9 85.84,120.86 85.84,116.04 v85.88,116.01 | U2.8 108.34,114.28 108.34,107.91 105.67,105.24 103.6,105.24 98.26,110.57 v98.26,113.78 98.26,119.32 106,127.06 U2.3 | U2.9 92.97,114.3 v89.32,114.3 | 53.18,147.77 52.07,146.67 52.07,132.99 JP6.18 44.2,125.12 v44.2,119.41 | FRENT.2 59.83,164.57 63.33,164.57 63.39,164.51 | 68.24,166.31 v68.24,166.59 65.47,166.59 63.39,164.51 | 63.39,164.51 v68.38,159.51 70.13,157.77 v89.16,157.77 93.89,162.49 DIR.2 | v63.61,157.37 63.59,157.39 63.7,157.49 66.04,157.49 v66.07,157.52 | v52,116.82 53.65,115.18 v53.65,113.42 | v55.01,110.17 53.71,108.87 48.38,108.87 47.62,108.1 47.62,107.02 49.43,105.21 JP6.8 | v93.45,64.97 v97.31,64.97 | v31.77,153.17 32.11,152.82 S2.NO 34.38,152.19 48.76,152.19 53.18,147.77 | SV4.12 40.91,185.1 v44.3,181.71 | v44.31,172.01 44.31,169.6 45.47,168.44 48.98,168.44 49.77,169.23 v49.77,170.18 | v111.03,154.05 111.03,150.19 109.13,148.28 ENCODER_RIGHT.5 | v18.91,30.7 20.24,32.03 31.68,32.03 v32.05,32.4 | v45.93,115.47 48.37,117.91 JP6.13 | v21.89,84.35 19.37,84.35 v19.25,84.47 | JP7.8 73.44,102.26 73.44,93.12 72.54,92.22 JP7.3
  pour Top: -7.54,-8.38 -7.54,200.21 133.1,200.21 133.1,-30.92 -7.53,-30.92 -7.53,-8.19
LED+
  Top 0.2: R10.1 50.25,18.93 50.87,18.31 50.87,14.81 DS1.15
ML1
  Top 1: U1.4 10.86,130.45 10.86,138.91 10.89,138.95 C5.2 9.79,143.13 5.91,139.26 ENCODER_LEFT.6
ML2
  Top 1: U1.5 8.34,123.68 14.64,129.98 14.64,142.35 11.96,145.03 C5.1 10.56,145.37 10.56,149.39 7.99,151.96 ENCODER_LEFT.1
ML3
  Top 1: ENCODER_LEFT1.6 6.64,46.71 C1.2 11.56,51.56 13.7,51.56 16.38,54.24 16.38,67.04 13.99,69.44 5.18,69.44 2.62,72 2.62,114.65 6.57,118.6 U1.7
ML4  (via drill 0.8)
  Top 1: U1.6 8.95,118.82 8.95,105.42 5.98,102.45 v5.98,73.44 | v6.01,66.1 6.01,62.95 11.52,57.43 C1.1 5.61,59.41 ENCODER_LEFT1.1
  Bottom 1: v5.98,73.44 6.01,73.4 v6.01,66.1
MR1
  Top 1: C6.2 100.82,147.69 103.95,150.82 ENCODER_RIGHT.6 108.69,150.82 110.58,148.94 110.58,126.16 109.34,124.92 U2.4
MR2
  Top 0.2: 106.87,138.18 108.12,138.18 ENCODER_RIGHT.1 | 100.87,141.56 C6.1 | 108.25,122.06 U2.5
  Top 1: 100.87,141.56 104.25,138.18 105.99,138.18 | 105.99,138.18 106.87,138.18 ENCODER_RIGHT.1 | 108.25,122.06 105.99,124.31 105.99,138.18
MR3
  Top 1: C2.2 103.74,51.93 104.63,52.82 104.63,55.29 | 104.63,55.29 104.63,115.74 105.84,116.95 108.21,116.95 U2.7 | 104.63,55.29 106.91,57.57 ENCODER_RIGHT1.6
MR4  (via drill 0.8)
  Top 1: ENCODER_RIGHT1.1 108.57,44.87 103.84,49.61 103.68,49.61 C2.1 105.05,50.03 107.07,52.04 v107.07,54.56 | v107.08,81.79 108.52,83.24 108.52,107.73 v106.97,109.29
  Bottom 1: v106.97,109.29 105.68,110.58 105.68,118.51 106.61,119.44 U2.6 | v107.07,54.56 107.07,81.78 v107.08,81.79
MUXA  (via drill 0.35)
  Top 0.2: v46.15,156.99 46.15,174.06 49.75,177.66 49.75,182.07 IC2.10 | v53.24,154.22 54.58,154.22 59.62,149.18 59.62,119.24 66.6,112.27 66.6,99.33 69.79,95.75 JP7.4
  Bottom 0.2: v53.24,154.22 52.91,154.22 52.89,154.2 47.5,154.2 46.15,155.55 v46.15,156.99
MUXB  (via drill 0.35)
  Top 0.2: v48.5,179.95 IC2.11 | v52.93,167.04 v52.93,167.03 52.93,158.12 62.04,149.02 62.04,118.72 67.3,113.46 67.3,100.89 70.75,97.44 JP7.5
  Bottom 0.2: v52.93,167.04 52.93,168 54.25,169.32 54.25,173.7 48.5,179.45 v48.5,179.95
MUXC  (via drill 0.35)
  Top 0.2: v55.23,116.13 55.25,116.15 55.25,129.06 54.62,129.68 54.62,148.81 48.58,154.86 48.58,172.59 IC2.14
  Bottom 0.2: JP7.6 70.78,99.96 55.23,115.51 v55.23,116.13
MUXD  (via drill 0.35)
  Top 0.2: v53.3,136.51 52.88,136.51 52.03,137.37 52,137.4 47.75,141.65 47.75,172.06 47.25,172.56 IC2.13 | v63.25,136.03 63.57,135.71 63.57,118.97 68.19,114.35 68.19,105.1 68.73,104.43 JP7.7
  Bottom 0.2: v63.25,136.03 62.83,136.45 53.37,136.45 v53.3,136.51
N$2
  Top 2: S1.2 91.84,102.54 84.99,109.39 D2.A
N$3
  Top 2: S1.1 97.54,106.55 102.12,101.97 102.12,96.18 95.65,89.71 94.31,89.71 BAT.1
N$4
  Top 0.2: R11.1 38.37,142.06 36.37,144.06 33.49,144.06 32.12,142.69 S2.NC
NET$15  (via drill 0.35)
  Top 0.2: 27.05,142.3 27.12,142.31 27.12,149.81 S2.1A | 27.05,142.3 S2.1B | v67.86,120.13 68.37,119.61 68.37,117.17 69.17,116.38 72.8,116.38 72.8,109.59 72.37,109.05 JP7.9 | v52.38,120.98 51.72,120.98 50.89,121.81 41.44,121.81 27.05,136.19 27.05,142.3
  Bottom 0.2: v67.86,120.13 66,121.99 53.38,121.99 v52.38,120.98
OUTL_A  (via drill 0.35)
  Top 0.2: v11.93,152.41 12.84,152.41 13.57,151.68 28.95,151.68 30.15,150.48 30.15,137.43 43.27,124.31 51.05,124.31 51.62,124.88 51.62,131.18 49.75,133.06 JP6.19
  Bottom 0.2: v11.93,152.41 10.72,152.41 5.55,147.24 ENCODER_LEFT.3
OUTL_B  (via drill 0.35)
  Top 0.2: v14.37,152.43 35.29,152.43 37.12,150.6 37.12,147.81 43.07,141.86 v43.15,141.86
  Bottom 0.2: v14.37,152.43 6.75,144.81 5.25,144.81 4.87,144.43 ENCODER_LEFT.4 | v43.15,141.86 43.15,141.78 49.13,135.81 49.62,135.81 JP6.20
OUTL_C  (via drill 0.35)
  Top 0.2: v45.5,79.43 47.75,81.68 47.75,87.93 48.37,88.56 52.62,88.56 54.75,86.43 54.75,84.6 55.62,83.72 v56.15,83.72 | JP7.1 70.78,86.82 69.21,85.24 69.12,85.19 57.82,85.19 v57.77,85.25
  Bottom 0.2: v45.5,79.43 29.87,79.43 5.37,54.93 4.75,54.93 4.25,54.43 ENCODER_LEFT1.3 | v56.15,83.72 57.68,85.25 v57.77,85.25
OUTL_D  (via drill 0.35)
  Top 0.2: v52.69,77.7 53.15,77.7 58.63,83.18 v64.37,83.18
  Bottom 0.2: v52.69,77.7 31.88,77.7 6.37,52.18 4.62,52.18 4.25,51.81 ENCODER_LEFT1.4 | v64.37,83.18 65.92,84.73 65.92,87.61 69.25,90.93 70.31,90.93 JP7.2
OUTR_A  (via drill 0.35)
  Top 0.2: v66.46,125.13 67.12,125.79 67.12,136.16 68.48,137.51 89.88,137.51 v89.88,137.5
  Bottom 0.2: v66.46,125.13 65.21,123.88 53.69,123.88 50.87,121.06 50.25,121.06 49.75,120.56 JP6.14 | v89.88,137.5 101.46,137.5 107.14,143.18 108.12,143.18 ENCODER_RIGHT.3
OUTR_B  (via drill 0.35)
  Top 0.2: v65.5,129.18 66.02,129.71 66.02,136.79 67.91,138.68 v100.62,138.68
  Bottom 0.2: v65.5,129.18 62.26,125.95 53.26,125.95 50.87,123.56 50.25,123.56 49.75,123.06 JP6.15 | v100.62,138.68 107.62,145.68 108.12,145.68 ENCODER_RIGHT.4
OUTR_C  (via drill 0.35)
  Top 0.2: v90.47,171.11 107.99,171.11 112.37,166.73 112.37,52.43 110,50.06 ENCODER_RIGHT1.3 | JP6.16 49.62,125.56 43.99,131.19 43.99,135.9 v47.72,139.63 | v50.63,141.87 v53.45,141.87 | v66.48,141.94 69.09,141.94 79.04,151.89 v79.04,158.94
  Bottom 0.2: v47.72,139.63 49.96,141.87 v50.63,141.87 | v53.45,141.87 66.41,141.87 v66.48,141.94 | v79.04,158.94 79.04,165.91 84.25,171.12 v90.46,171.12 v90.47,171.11
OUTR_D  (via drill 0.35)
  Top 0.2: v105.78,107.36 105.8,107.34 105.8,71.58 111.87,65.51 111.87,54.43 110,52.56 ENCODER_RIGHT1.4 | v101.84,112.35 97.91,116.28 97.91,132.44 95.04,135.31 73.94,135.31 72.62,134 69.02,134 67.87,132.85 v67.87,132.68
  Bottom 0.2: v105.78,107.36 105.78,108.41 v101.84,112.35 | v101.84,112.35 | v67.87,132.68 63.12,127.93 49.87,127.93 49.75,128.06 JP6.17
PIN1
  Top 0.2: IC2.9 51,182.18 50.5,182.68 50.5,183.18 49.4,184.28 45.47,184.28 43.5,186.26 43.5,187.56 SV4.11
PIN2
  Top 0.2: IC2.8 52.25,182.18 51.75,182.68 51.75,183.19 49.65,185.29 47.33,185.29 46,186.62 46,187.56 SV4.10
PIN3
  Top 0.2: IC2.7 53.5,182.18 53,182.68 53,183.31 48.62,187.68 SV4.9
PIN4
  Top 0.2: IC2.6 54.75,182.18 54.37,182.56 54.37,184.31 51.12,187.56 SV4.8
PIN5
  Top 0.2: IC2.5 56,182.18 55.62,182.56 55.62,185.56 53.62,187.56 SV4.7
PIN6
  Top 0.2: IC2.4 57.37,182.18 56.87,182.68 56.87,186.93 56.25,187.56 SV4.6
PIN7
  Top 0.2: SV4.5 58.84,187.45 58.84,182.28 IC2.3
PIN8
  Top 0.2: IC2.2 60,182.18 60.5,182.68 60.5,186.93 61.12,187.56 SV4.4
PIN9
  Top 0.2: IC2.23 60,172.68 60.5,173.18 60.5,176.93 62.75,179.18 62.75,185.93 63.75,186.93 63.75,187.56 SV4.3
PIN10  (via drill 0.35)
  Top 0.2: v62.01,183.9 62.01,179.2 59.25,176.43 59.25,173.18 58.75,172.68 IC2.22
  Bottom 0.2: v62.01,183.9 62.01,184.46 62.86,185.31 64.5,185.31 66.25,187.06 66.25,187.56 SV4.2
PIN11  (via drill 0.35)
  Top 0.2: v58.36,177.23 57.87,176.75 57.87,173.06 57.5,172.68 IC2.21
  Bottom 0.2: v58.36,177.23 58.38,177.21 59.54,178.38 66.67,178.38 69,180.7 69,187.56 68.87,187.56 SV4.1
PWMA
  Top 0.508: U1.16 24.37,133.84 46.16,112.05 46.16,96.53 47.63,95.05 JP6.4
PWMB
  Bottom 0.508: JP6.5 46.52,97.59 43.89,100.22 43.89,111.58 36.88,118.6 U1.10
PWMC  (via drill 0.8)
  Top 0.508: U2.16 88.48,132.14 74.97,118.63 v74.97,115.46
  Bottom 0.2: JP6.9 49.7,107.76 50.42,107.76 50.5,107.69
  Bottom 0.508: v74.97,115.46 74.97,86.8 70.35,82.18 64.02,82.18 53.36,92.84 53.36,105.59 51.26,107.69 50.5,107.69
PWMD
  Top 0.508: JP6.10 50.83,110.29 55.42,105.71 55.42,85.96 57.2,84.17 70.65,84.17 76.57,90.1 76.57,112.27 81.2,116.9 U2.10
RX0
  Top 0.2: SV2.3 27.89,98.9 36.36,90.43 49.62,90.43 49.62,90.06 JP6.2
RX1  (via drill 0.35)
  Top 0.2: v79.12,113.56 79.12,106.69 87.64,98.17 87.64,80.31 94.5,73.46 94.5,31.93 104.5,21.93 JP9.2 | v58.17,110.96 58.22,110.96 58.24,110.98 63.23,110.98 v63.34,111.09
  Bottom 0.2: v79.12,113.56 79.12,113.98 76.04,117.06 75.17,117.06 72.04,113.92 66.18,113.92 v63.34,111.09 | JP6.12 49.69,115.28 54.07,110.9 58.11,110.9 v58.17,110.96
S1
  Top 0.2: R1.2 55.37,156.72 55.37,157.56 59.75,161.93 FRENT.3
S1_OUT
  Top 0.2: R1.1 60.4,156.95 R2.2 60.87,157.08 60.87,162.43 56.62,166.68 56.62,172.06 56.12,172.56 IC2.20
S2  (via drill 0.35)
  Top 0.2: v7.5,159.93 7.5,158.18 10.87,154.81 R4.2
  Bottom 0.2: v7.5,159.93 6.12,161.31 5.62,161.31 ESQ.3
S2_OUT  (via drill 0.35)
  Top 0.2: R4.1 12.87,154.81 16.25,154.81 R5.2 16.37,154.93 16.37,157.25 18.53,159.41 33,159.41 v38.68,165.1 | v53,170.18 54.29,171.48 54.29,172.11 54.75,172.56 IC2.19
  Bottom 0.2: v53,170.18 49.73,166.92 40.5,166.92 v38.68,165.1
S3
  Top 0.2: R6.2 98.4,161.22 102.17,164.99 DIR.3
S3_OUT  (via drill 0.35)
  Top 0.2: R6.1 96.5,154.18 93.37,154.18 R7.2 93.25,154.18 93.25,157.77 71.46,179.56 65.97,179.56 v65.95,179.58 | v60.26,179.57 59.07,179.57 53.58,174.08 IC2.18
  Bottom 0.2: v65.95,179.58 v60.26,179.58 v60.26,179.57
S4
  Top 0.2: R8.2 66.08,27.91 64.75,26.63 64.75,22.31 TRAS.3
S4_OUT  (via drill 0.35)
  Top 0.2: v63.75,104.31 62.51,104.31 57.12,109.7 57.12,148.81 51.75,154.18 51.75,171.85 IC2.17 | v65.25,102.81 65.9,102.15 65.9,95.5 60.9,90.5 59.42,90.5 v56.88,87.97 | v73.88,79.18 73.88,76.39 50.86,53.38 50.86,33.59 53.19,31.27 62.18,31.27 63.72,32.81 64.08,32.81 | R9.2 71.92,32.81 64.08,32.81 | R8.1 64.08,32.81
  Bottom 0.2: v63.75,104.31 v63.75,104.29 65.23,102.81 v65.25,102.81 | v56.88,87.97 56.88,87.33 58.47,85.74 58.47,85.73 63.98,80.21 72.85,80.21 v73.88,79.18
SCL  (via drill 0.35)
  Top 0.2: R12.1 63,100.93 58.75,100.93 R15.1 58.62,101.06 57.07,101.06 56.09,102.04 56.09,107.96 | v12.62,84.18 11.5,83.06 11.5,82.06 U4.12 | v24,92.06 26,94.06 26,99.44 26.87,100.31 38.68,100.31 41.31,102.93 v45.25,102.93 | 56.09,107.96 52.47,111.59 48.4,111.59 47.59,110.78 47.59,103.91 48.67,102.82 JP6.7 | 56.09,107.96 56.09,147.44 SV1.6
  Bottom 0.2: v12.62,84.18 18.12,89.68 21.62,89.68 v24,92.06 | v45.25,102.93 45.26,102.95 49.42,102.95 JP6.7
SDA  (via drill 0.35)
  Top 0.2: SV1.5 58.37,147.69 58.37,118.27 64.5,112.15 64.5,97.18 62.75,95.43 R13.1 62.62,95.31 58.62,95.31 R14.1 58.5,95.31 v56.37,95.31 | v12.62,85.31 10.75,83.43 10.75,82.06 U4.13 | v30.18,97.74 34.2,93.72 50.8,93.72 51.62,94.54 51.62,94.61 | 51.62,94.61 51.62,98.18 49.75,100.06 JP6.6 | v54.5,95.43 53.67,94.61 51.62,94.61
  Bottom 0.2: v12.62,85.31 25.05,97.74 v30.18,97.74 | v56.37,95.31 56.25,95.43 v54.5,95.43
TX0
  Top 0.2: SV2.2 28,96.31 29.57,96.31 35.94,89.93 41.53,89.93 44.75,86.72 44.75,79.06 45.12,78.68 48.37,78.68 49.62,79.94 49.62,87.31 JP6.1
TX1  (via drill 0.35)
  Top 0.2: v80.89,113.63 80.89,108.22 89.01,100.1 89.01,80.04 96.1,72.96 96.1,32.83 107,21.93 JP9.1 | v54.5,117.81 49.75,113.06 49.75,112.93 JP6.11
  Bottom 0.2: v80.89,113.63 75.75,118.78 55.47,118.78 v54.5,117.81
V0
  Top 0.2: R3.2 19.8,26.07 19.8,15.95 DS1.3
VCC  (via drill 0.35)
  Top 0.2: U4.18 12.12,75.06 v12.12,77.43 12.12,79.81 13.37,81.06 13.37,81.93 U4.9 13.37,82.06 13.37,87.44 9.27,91.54 C3.1 9.11,93.3 13.75,97.93 | 13.75,97.93 13.75,104.06 AMS1117.4 | 13.75,97.93 | 13.75,97.93 13.75,97.56 AMS1117.2 | 13.75,97.93 AMS1117.2 | R12.2 62.89,102.79 v60.98,102.79 60.96,102.82 60.91,102.8 58.76,102.8 R15.2 | R14.2 58.62,97.18 v60.62,97.18 62.62,97.18 R13.2 | v29.25,126.93 29.25,125.68 C8.1 | v40.37,143.43 40.37,142.06 R11.2 | v50.13,23.7 R10.2 | C7.1 85.37,125.68 91.87,125.68 93,124.56 U2.13 | v66.9,174.02 69.67,174.02 71.82,171.87 C10.1 | IC2.24 61.37,172.47 v62.88,172.47 | AMS1117.2 13.65,97.39
  Top 0.508: v33.82,90.32 28.2,90.32 v26.29,92.23 | v24.26,95.55 24.26,96.44 24.91,97.09 24.91,102.79 v24.48,103.22 | 13.65,97.39 13.65,96.54 14.2,95.99 v14.53,95.99
  Bottom 0.2: v62.88,172.47 64.44,174.02 v66.9,174.02 | U1.13 23.2,127.55 28.63,127.55 v29.25,126.93
  Bottom 0.508: SV3.1 40.18,96.19 34.31,90.32 v33.82,90.32 | v26.29,92.23 24.26,94.26 v24.26,95.55 | v24.48,103.22 21.76,103.22 v14.53,95.99
  pour Bottom: -16.77,-30.1 -16.77,209.78 148.3,209.78 148.3,-41.25 -16.76,-41.25 -16.76,-30.01
VCC_OUT  (via drill 0.35)
  Top 0.2: 44.92,108.99 v44.92,109.08
  Top 0.406: 52.37,119.21 48.16,119.21
  Top 0.508: 48.16,119.21 46.89,117.94 v46.89,112.8 | 52.37,119.21 53.49,120.32 53.49,129 v53.72,129.23 | v41.26,105.34 44.92,108.99
  Bottom 0.2: 41.25,105.34 v41.26,105.34
  Bottom 0.508: v53.72,129.23 58.55,134.06 69.69,134.06 JP7.19 | SV3.2 37.64,101.73 41.25,105.34 | v44.92,109.08 46.89,111.06 v46.89,112.8
VIN
  Top 2: D2.C 83.66,92.96 77.3,86.59 | 77.3,86.59 77.3,86.43 87.46,76.27 | 87.46,76.27 90.96,72.77 IC1.1 92.77,72.45 C9.1 | AMS1117.3 17.96,97.49 20.75,94.7 20.75,93.22 C4.1 20.85,92.78 28.71,84.92 35.55,84.92 44.43,76.04 66.74,76.04 77.3,86.59 | JP8.1 87.46,51.57 | 87.46,51.57 87.46,76.27 | 87.46,51.57 56.55,51.57 54.24,49.26 54.24,34.27 JP1.1
VMOT
  Bottom 2: U1.1 5.4,133.84 2.22,130.66 2.22,114.18 5.95,110.44 29.55,110.44 31.95,108.04 31.95,88.35 39.08,81.22 53.77,81.22 JP4.1 59.21,76.69 80.55,76.69 89.47,85.6 108.13,85.6 111.42,88.9 111.42,130.73 110.01,132.14 U2.1